# EAGLE design DualMotorCape-v6 (EAGLE 6.4)
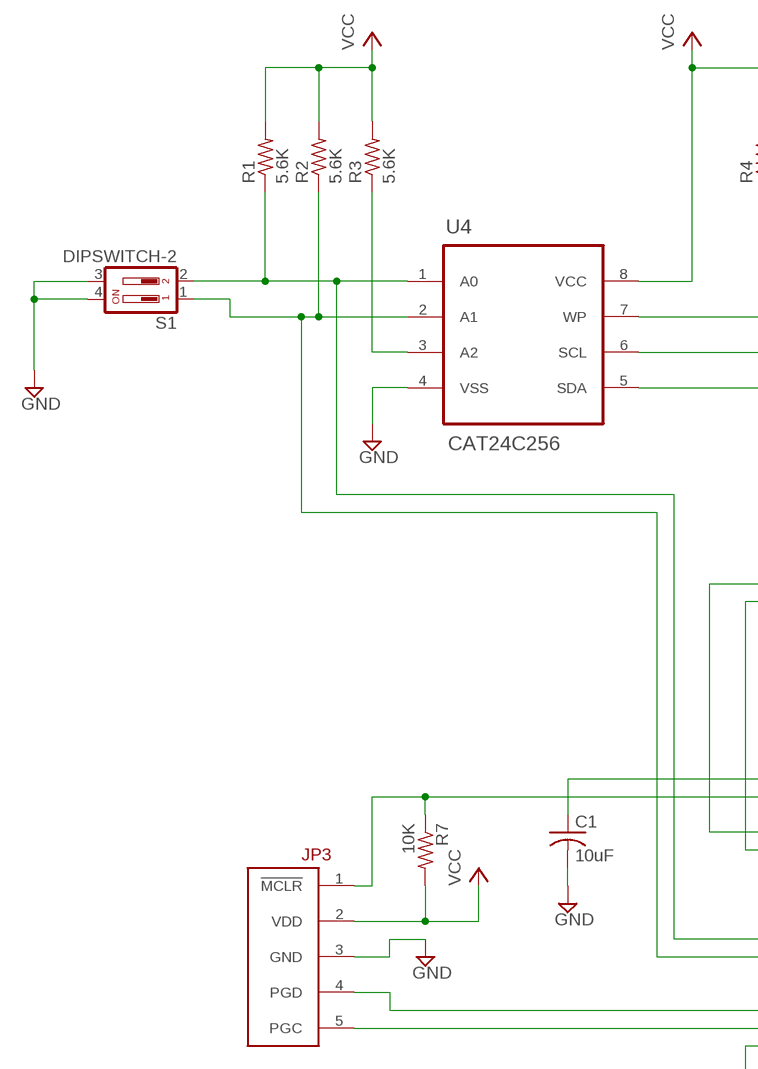
[diagram p0: schematic, sheet 1, part 1 of 2]
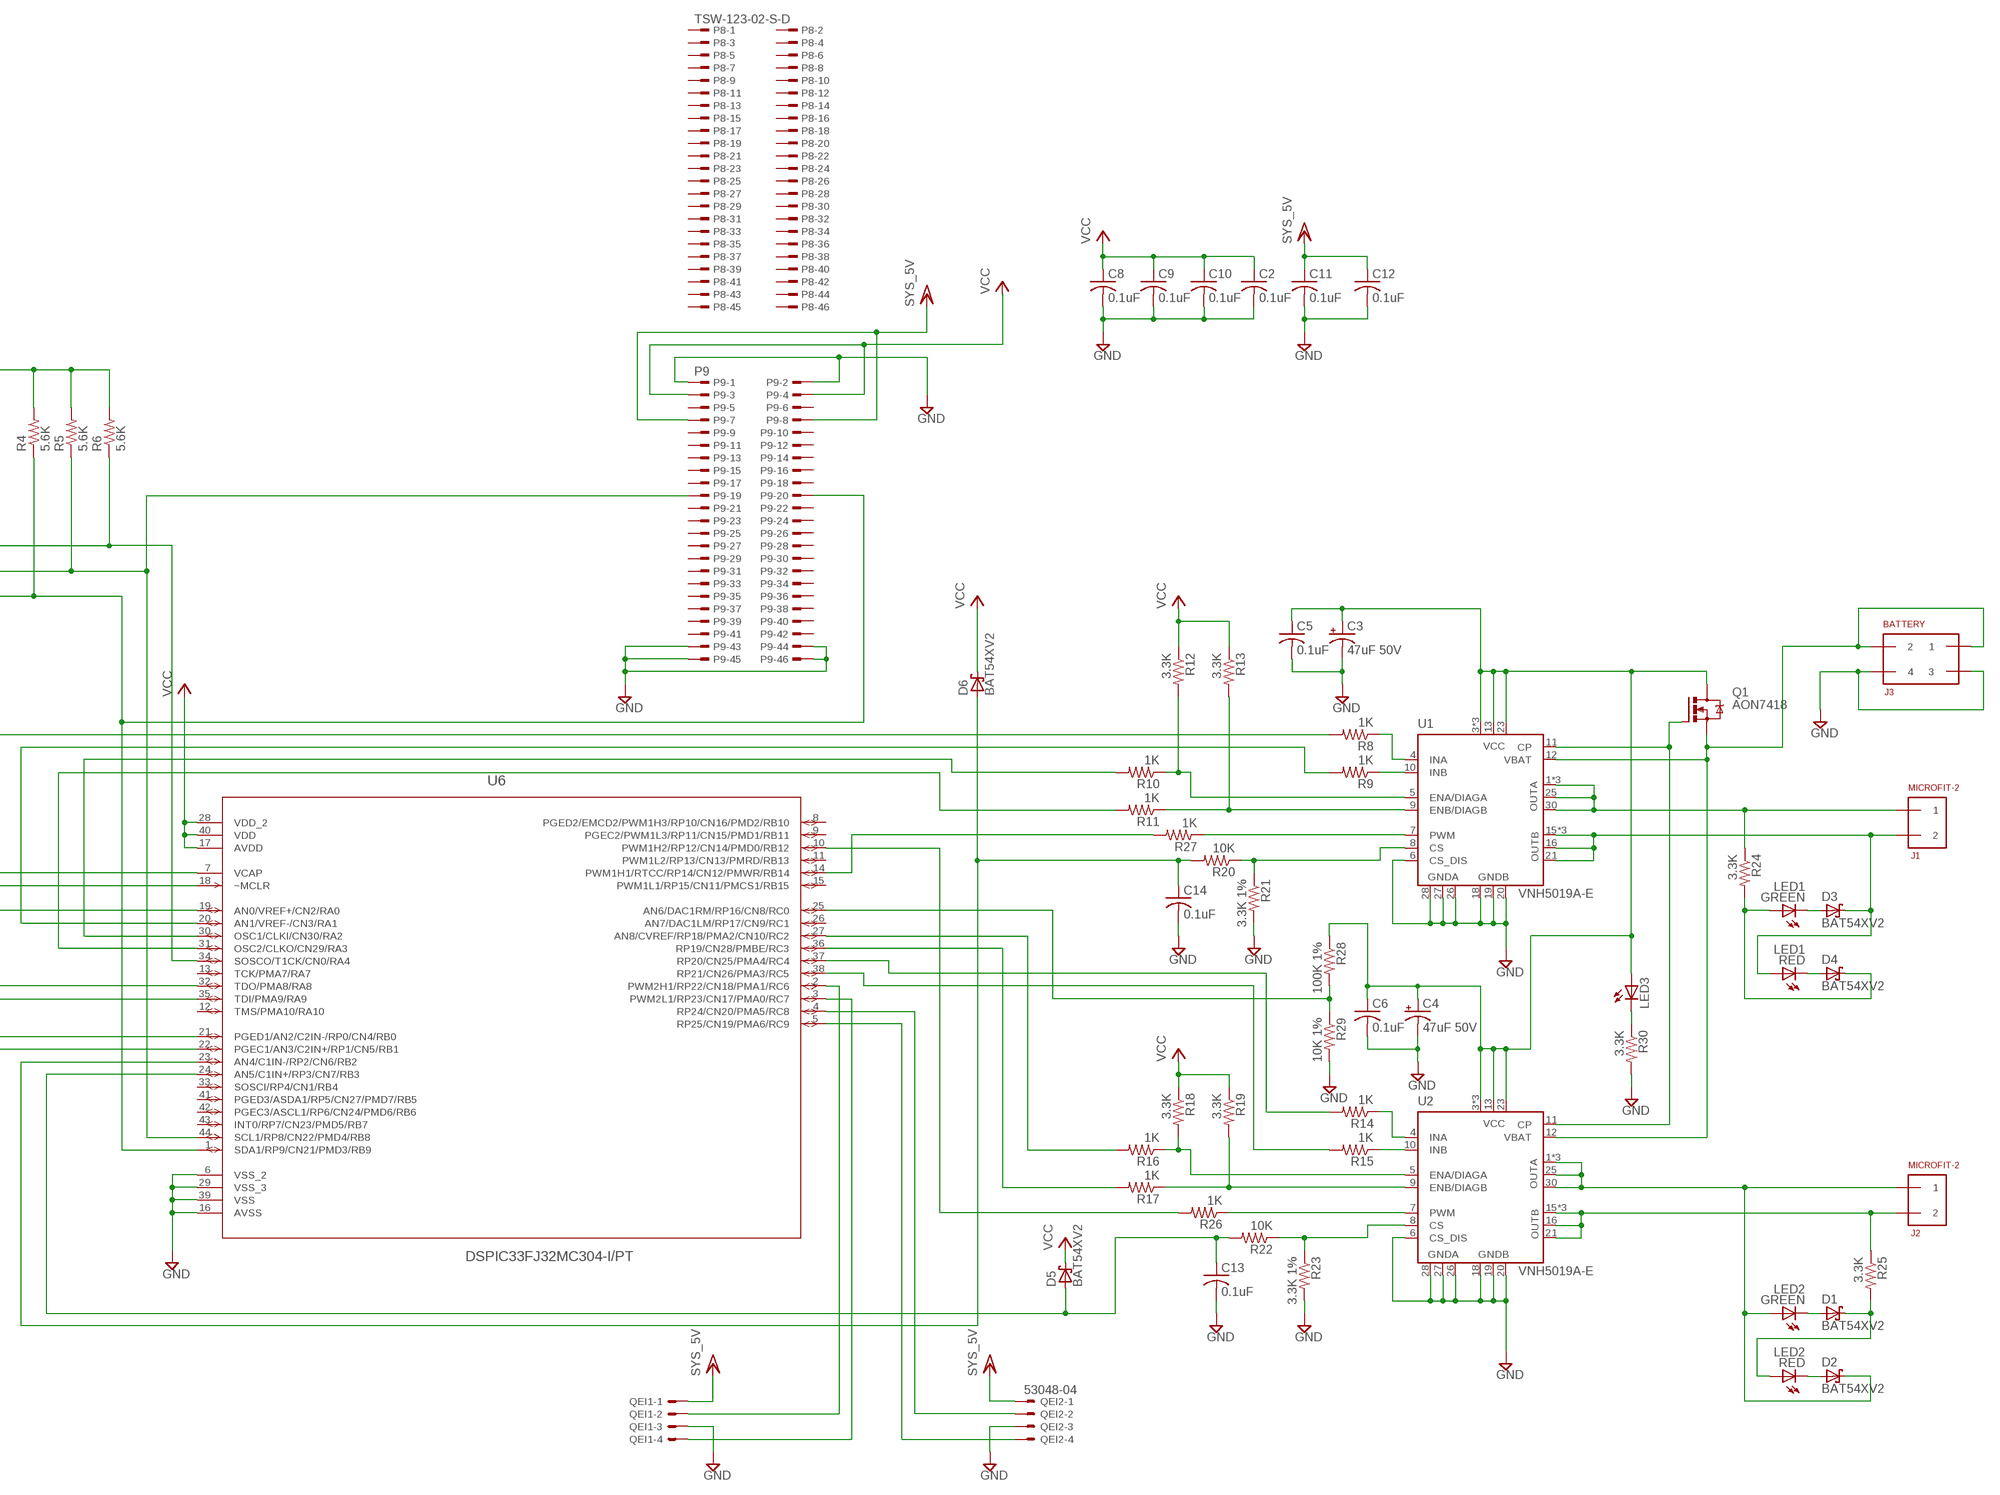
[diagram p1: schematic, sheet 1, part 2 of 2]

## Parts
C1  10uF  C-USC0805  [C0805]
C2  0.1uF  C-USC0603  [C0603]
C3  47uF 50V  CPOL-USUD-8X10  [UD-8X10_NICHICON]
C4  47uF 50V  CPOL-USUD-8X10  [UD-8X10_NICHICON]
C5  0.1uF  C-USC0603  [C0603]
C6  0.1uF  C-USC0603  [C0603]
C8  0.1uF  C-USC0603  [C0603]
C9  0.1uF  C-USC0603  [C0603]
C10  0.1uF  C-USC0603  [C0603]
C11  0.1uF  C-USC0603  [C0603]
C12  0.1uF  C-USC0603  [C0603]
C13  0.1uF  C-USC0603  [C0603]
C14  0.1uF  C-USC0603  [C0603]
D1  BAT54XV2  [SOD523]
D2  BAT54XV2  [SOD523]
D3  BAT54XV2  [SOD523]
D4  BAT54XV2  [SOD523]
D5  BAT54XV2  [SOD523]
D6  BAT54XV2  [SOD523]
J1  MICROFIT-2  [MICROFIT-2-R-TH]
J2  MICROFIT-2  [MICROFIT-2-R-TH]
J3  BATTERY  MICROFIT-4  [MICROFIT-4-R-TH]
JP3  ICD2/3-HEADER  [ICD2/3-HEADER]
LED1  KINGBRIGHT-BI-COLOR-LED  [LED-1.6X1.5MM-BI-COLOR]
LED2  KINGBRIGHT-BI-COLOR-LED  [LED-1.6X1.5MM-BI-COLOR]
LED3  LED-LNJP12X8ARA  [LED-603-PANASONIC]
P8  TSW-123-02-S-D  [TSW-123-02-S-D]
P9  P9  TSW-123-02-S-D  [TSW-123-02-S-D]
Q1  AON7418  MOSFET-N  [DFN3.3X3.3]
QEI1  53048-04  [53048-04]
QEI2  53048-04  [53048-04]
R1  5.6K  R-US_R0603  [R0603]
R2  5.6K  R-US_R0603  [R0603]
R3  5.6K  R-US_R0603  [R0603]
R4  5.6K  R-US_R0603  [R0603]
R5  5.6K  R-US_R0603  [R0603]
R6  5.6K  R-US_R0603  [R0603]
R7  10K  R-US_R0603  [R0603]
R8  1K  R-US_R0603  [R0603]
R9  1K  R-US_R0603  [R0603]
R10  1K  R-US_R0603  [R0603]
R11  1K  R-US_R0603  [R0603]
R12  3.3K  R-US_R0603  [R0603]
R13  3.3K  R-US_R0603  [R0603]
R14  1K  R-US_R0603  [R0603]
R15  1K  R-US_R0603  [R0603]
R16  1K  R-US_R0603  [R0603]
R17  1K  R-US_R0603  [R0603]
R18  3.3K  R-US_R0603  [R0603]
R19  3.3K  R-US_R0603  [R0603]
R20  10K  R-US_R0603  [R0603]
R21  3.3K 1%  R-US_R0603  [R0603]
R22  10K  R-US_R0603  [R0603]
R23  3.3K 1%  R-US_R0603  [R0603]
R24  3.3K  R-US_R0603  [R0603]
R25  3.3K  R-US_R0603  [R0603]
R26  1K  R-US_R0603  [R0603]
R27  1K  R-US_R0603  [R0603]
R28  100K 1%  R-US_R0603  [R0603]
R29  10K 1%  R-US_R0603  [R0603]
R30  3.3K  R-US_R0603  [R0603]
S1  DIPSWITCH-2  [DIPSWITCH-218-2]
U1  VNH5019A-E  [VNH5019A-E]
U2  VNH5019A-E  [VNH5019A-E]
U4  CAT24C256  [SOIC-8]
U6  DSPIC33FJ32MC304-I/PT  [QFP80P1200X1200X120-44N]

## Nets
GND: C1.2 C2.2 C3.- C4.- C5.2 C6.2 C8.2 C9.2 C10.2 C11.2 C12.2 C13.2 C14.2 J3.3 J3.4 JP3.3(GND) P9.1 P9.2 P9.43 P9.44 P9.45 P9.46 QEI1.3 QEI2.3 R21.2 R23.2 R29.2 R30.2 S1.3 S1.4 U1.6(CS_DIS) U1.18(GNDB) U1.19(GNDB) U1.20(GNDB) U1.26(GNDA) U1.27(GNDA) U1.28(GNDA) U2.6(CS_DIS) U2.18(GNDB) U2.19(GNDB) U2.20(GNDB) U2.26(GNDA) U2.27(GNDA) U2.28(GNDA) U4.4(VSS) U6.6(VSS_2) U6.16(AVSS) U6.29(VSS_3) U6.39(VSS)
M1+: J1.2 R24.1 U1.1(OUTA) U1.25(OUTA) U1.30(OUTA) U1.NC/OUTA(OUTA) U1.NC/OUTA@1(OUTA)
M1-: D3.C J1.1 LED1.1 U1.15(OUTB) U1.16(OUTB) U1.21(OUTB) U1.NC/OUTB(OUTB) U1.NC/OUTB@1(OUTB)
M2+: D2.C J2.2 LED2.3 U2.1(OUTA) U2.25(OUTA) U2.30(OUTA) U2.NC/OUTA(OUTA) U2.NC/OUTA@1(OUTA)
M2-: J2.1 R25.1 U2.15(OUTB) U2.16(OUTB) U2.21(OUTB) U2.NC/OUTB(OUTB) U2.NC/OUTB@1(OUTB)
N$1: D4.C LED1.3 R24.2
N$2: LED3.2(C) R30.1
N$4: Q1.4(G) U1.11(CP) U2.11(CP)
N$6: JP3.1(!MCLR) R7.1 U6.18(~MCLR)
N$9: D3.A LED1.4
N$10: R3.1 U4.3(A2)
N$11: R6.1 U4.7(WP) U6.34(SOSCO/T1CK/CN0/RA4)
N$12: P9.19 R5.1 U4.6(SCL) U6.44(SCL1/RP8/CN22/PMD4/RB8)
N$13: P9.20 R4.1 U4.5(SDA) U6.1(SDA1/RP9/CN21/PMD3/RB9)
N$14: JP3.5(PGC) U6.22(PGEC1/AN3/C2IN+/RP1/CN5/RB1)
N$16: JP3.4(PGD) U6.21(PGED1/AN2/C2IN-/RP0/CN4/RB0)
N$18: R11.1 R13.2 U1.9(ENB/DIAGB)
N$19: R10.1 R12.2 U1.5(ENA/DIAGA)
N$20: R27.2 U6.14(PWM1H1/RTCC/RP14/CN12/PMWR/RB14)
N$21: R8.1 U1.4(INA)
N$22: R9.1 U1.10(INB)
N$23: R15.1 U2.10(INB)
N$24: R14.1 U2.4(INA)
N$27: R17.2 U6.36(RP19/CN28/PMBE/RC3)
N$28: R22.1 R23.1 U2.8(CS)
N$29: R20.1 R21.1 U1.8(CS)
N$32: R10.2 U6.30(OSC1/CLKI/CN30/RA2)
N$33: R11.2 U6.31(OSC2/CLKO/CN29/RA3)
N$35: R14.2 U6.37(RP20/CN25/PMA4/RC4)
N$36: R15.2 U6.38(RP21/CN26/PMA3/RC5)
N$37: R16.2 U6.27(AN8/CVREF/RP18/PMA2/CN10/RC2)
N$39: QEI1.2 U6.2(PWM2H1/RP22/CN18/PMA1/RC6)
N$40: QEI1.4 U6.3(PWM2L1/RP23/CN17/PMA0/RC7)
N$43: R26.1 U2.7(PWM)
N$44: R28.2 R29.1 U6.25(AN6/DAC1RM/RP16/CN8/RC0)
N$45: D1.A LED2.4
N$46: R27.1 U1.7(PWM)
N$47: C1.1 U6.7(VCAP)
N$49: C3.+ C4.+ C5.1 C6.1 LED3.1(A) Q1.5(D) Q1.6(D) Q1.7(D) Q1.8(D) Q1.9(D) R28.1 U1.3(VCC) U1.13(VCC) U1.23(VCC) U1.NC/VCC(VCC) U1.NC/VCC@1(VCC) U2.3(VCC) U2.13(VCC) U2.23(VCC) U2.NC/VCC(VCC) U2.NC/VCC@1(VCC)
N$50: D4.A LED1.2
N$52: D2.A LED2.2
N$53: D1.C LED2.1 R25.2
PWM1H2: R26.2 U6.10(PWM1H2/RP12/CN14/PMD0/RB12)
RA0: R8.2 U6.19(AN0/VREF+/CN2/RA0)
RA1: R9.2 U6.20(AN1/VREF-/CN3/RA1)
RB2: C14.1 D6.A R20.2 U6.23(AN4/C1IN-/RP2/CN6/RB2)
RB3: C13.1 D5.A R22.2 U6.24(AN5/C1IN+/RP3/CN7/RB3)
RB6: QEI2.2 U6.4(RP24/CN20/PMA5/RC8)
RB7: QEI2.4 U6.5(RP25/CN19/PMA6/RC9)
RC8: R1.1 S1.2 U4.1(A0) U6.32(TDO/PMA8/RA8)
RC9: R2.1 S1.1 U4.2(A1) U6.35(TDI/PMA9/RA9)
U2ENA: R16.1 R18.2 U2.5(ENA/DIAGA)
U2ENB: R17.1 R19.2 U2.9(ENB/DIAGB)
VBAT: J3.1 J3.2 Q1.1(S) Q1.2(S) Q1.3(S) U1.12(VBAT) U2.12(VBAT)
VCC: C2.1 C8.1 C9.1 C10.1 D5.C D6.C JP3.2(VDD) P9.3 P9.4 R1.2 R2.2 R3.2 R4.2 R5.2 R6.2 R7.2 R12.1 R13.1 R18.1 R19.1 U4.8(VCC) U6.17(AVDD) U6.28(VDD_2) U6.40(VDD)
VCC/2: C11.1 C12.1 P9.7 P9.8 QEI1.1 QEI2.1 ; supply symbol labelled SYS_5V
Unconnected: P8.1 P8.2 P8.3 P8.4 P8.5 P8.6 P8.7 P8.8 P8.9 P8.10 P8.11 P8.12 P8.13 P8.14 P8.15 P8.16 P8.17 P8.18 P8.19 P8.20 P8.21 P8.22 P8.23 P8.24 P8.25 P8.26 P8.27 P8.28 P8.29 P8.30 P8.31 P8.32 P8.33 P8.34 P8.35 P8.36 P8.37 P8.38 P8.39 P8.40 P8.41 P8.42 P8.43 P8.44 P8.45 P8.46 P9.5 P9.6 P9.9 P9.10 P9.11 P9.12 P9.13 P9.14 P9.15 P9.16 P9.17 P9.18 P9.21 P9.22 P9.23 P9.24 P9.25 P9.26 P9.27 P9.28 P9.29 P9.30 P9.31 P9.32 P9.33 P9.34 P9.35 P9.36 P9.37 P9.38 P9.39 P9.40 P9.41 P9.42 U6.8(PGED2/EMCD2/PWM1H3/RP10/CN16/PMD2/RB10) U6.9(PGEC2/PWM1L3/RP11/CN15/PMD1/RB11) U6.11(PWM1L2/RP13/CN13/PMRD/RB13) U6.12(TMS/PMA10/RA10) U6.13(TCK/PMA7/RA7) U6.15(PWM1L1/RP15/CN11/PMCS1/RB15) U6.26(AN7/DAC1LM/RP17/CN9/RC1) U6.33(SOSCI/RP4/CN1/RB4) U6.41(PGED3/ASDA1/RP5/CN27/PMD7/RB5) U6.42(PGEC3/ASCL1/RP6/CN24/PMD6/RB6) U6.43(INT0/RP7/CN23/PMD5/RB7)

## Library data of the parts
C1 C2 C5 C6 C8-C14 = rcl:C-US: CAPACITOR, American symbol
C3 C4 = rcl:CPOL-US: POLARIZED CAPACITOR, American symbol; DIGIKEY: 493-2303-1-ND
D1-D6 = MyCustom:BAT54XV2: Schottky Diodes Source: Fairchild .. BAT54.pdf; DIGIKEY#: BAT54XV2CT-ND
J1 J2 = MyCustom:MICROFIT-2
J3 = MyCustom:MICROFIT-4
JP3 = MyCustom:ICD2/3-HEADER
LED1 LED2 = MyCustom:KINGBRIGHT-BI-COLOR-LED: BI-COLOR SMD CHIP LED 1.6x1.5mm http://www.us.kingbright.com/images/catalog/SPEC/APTB1615ESGC-F01.pdf
LED3 = MyCustom:LED-LNJP12X8ARA
P8 P9 = con-samtec:TSW-123-02-S-D: THROUGH-HOLE .025" SQ POST HEADER Source: Samtec TSW.pdf; OC_FARNELL: unknown; OC_NEWARK: unknown
Q1 = MyCustom:MOSFET-N: MOSFET N-Channel http://www.aosmd.com/res/data_sheets/AON7418.pdf http://www.aosmd.com/res/packaging_information/DFN3.3x3.3.pdf
QEI1 QEI2 = con-molex:53?-04: CONNECTOR wire to board 1.25 mm (.049 inch) pitch header; MF: MOLEX; MPN: 53048-0410; OC_FARNELL: 1462887; OC_NEWARK: 57H4721
R1-R30 = rcl:R-US_: RESISTOR, American symbol
S1 = MyCustom:DIPSWITCH-2; DIGIKEY#: CT2182LPST-ND
U1 U2 = MyCustom:VNH5019A-E
U4 = MyCustom:CAT24C256: ON Semi CAT24C256 CMOS Serial EEPROM http://www.onsemi.com/pub_link/Collateral/CAT24C256-D.PDF
U6 = MyCustom:DSPIC33FJ32MC304-I/PT: 16-bit Digital Signal Controllers; DESCRIPTION: 16-bit Digital Signal Controllers; MPN: dspic33fj32mc304-I/pt; OC_FARNELL: 1576821; OC_NEWARK: 39M8208; PACKAGE: TQFP-44; SUPPLIER: Microchip

## Board
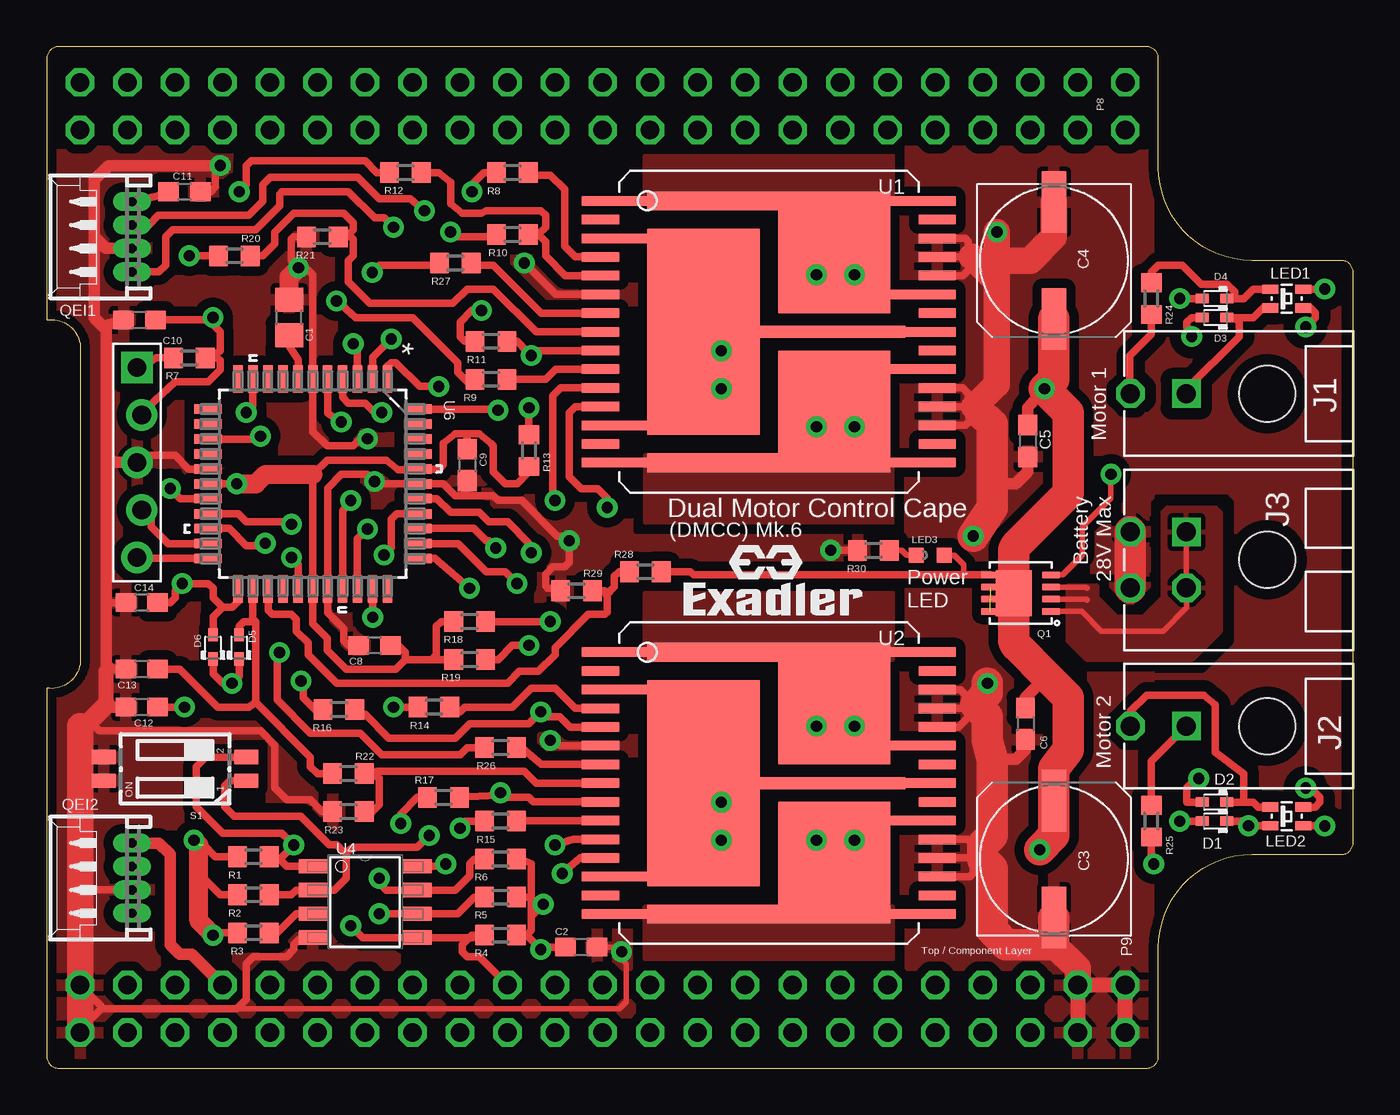
[diagram p2: board, top side]
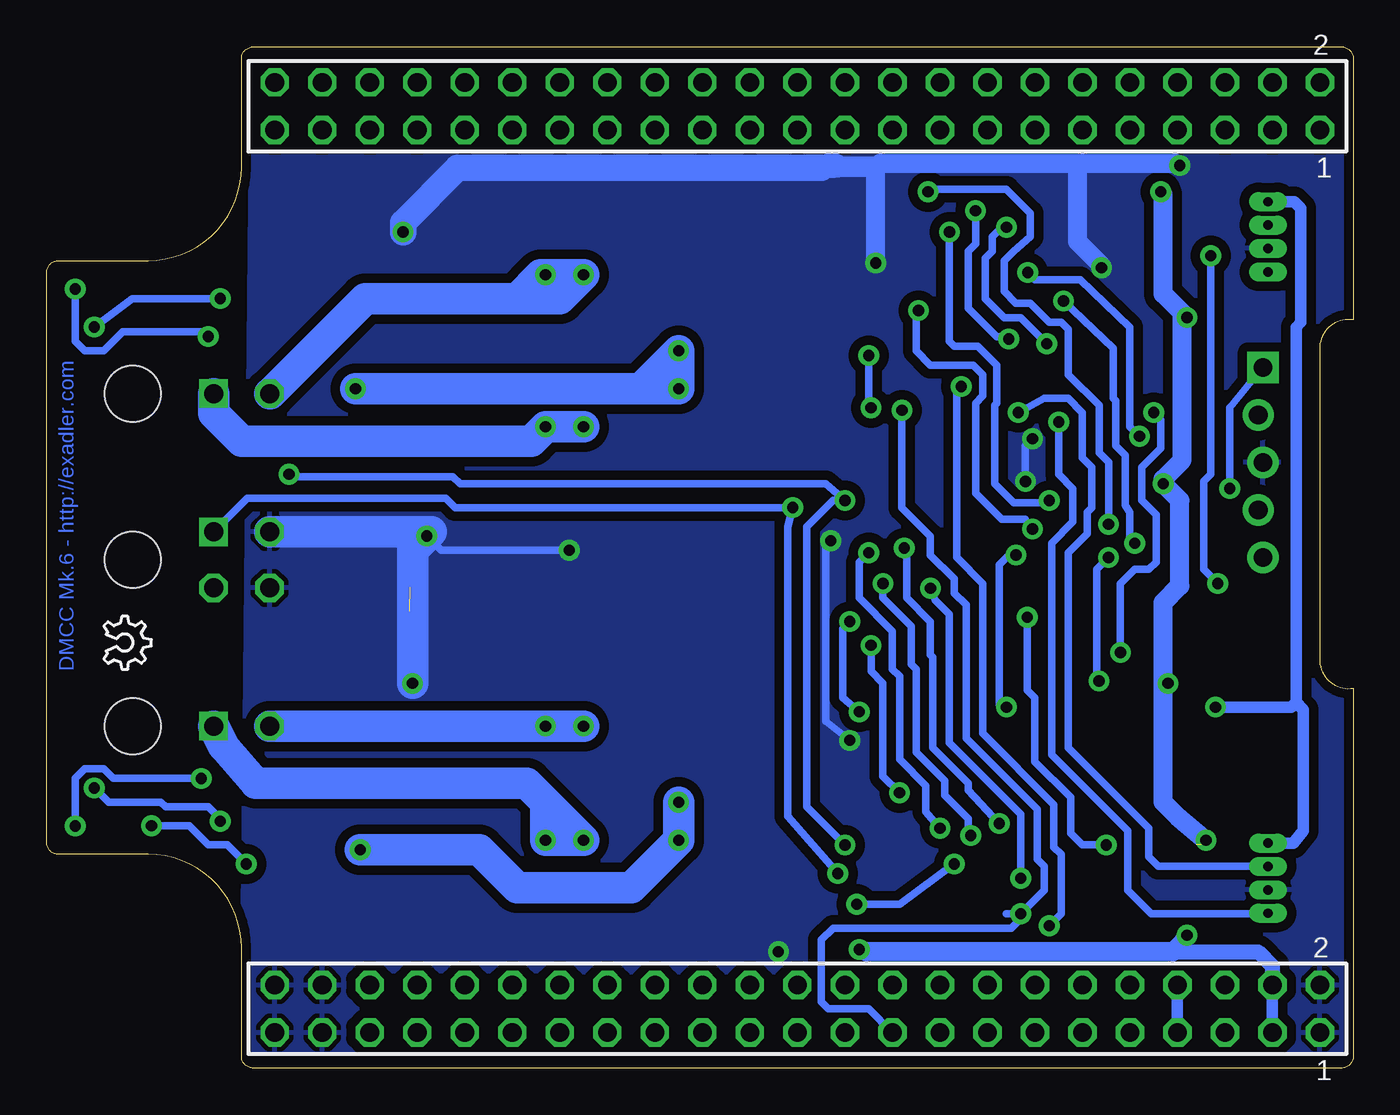
[diagram p3: board, bottom side, seen from below]

Size 69.85 x 54.61 mm. Coordinates in mm from the lower left corner, seen from the top.
Outline: 0,20.32 0,0.64 arc90 0.64,0 58.8,0 arc90 59.44,0.64 59.44,6.43 arc-90 64.44,11.43 69.22,11.43 arc90 69.85,12.06 69.85,42.55 arc90 69.22,43.18 64.44,43.18 arc-90 59.44,48.18 59.44,53.98 arc90 58.8,54.61 0.64,54.61 arc90 0,53.98 0,40.01 arc-90 1.78,38.73 1.78,21.59 arc-90 0,20.32
Copper layers (1*16): Top 0.035mm / dielectric 1.5mm / Bottom 0.035mm
Design rules "10-10-DRC": minimum track width 10mil, minimum drill 20mil, track to track 10mil, track to pad 10mil, pad to pad 10mil, via to via 10mil, smd to smd 4mil, copper to edge 10mil, drill to drill 10mil, minimum pad ring 10mil, minimum via ring 10mil, stop-mask expansion 4mil, vias tented up to drill 25mil, thermal gap 10mil

### Footprints (pad centres in the part's own frame; a part is rotated, then mirrored left to right if it is on the bottom)
C0805 = smd 1.3 x 1.5: 1 -0.95,0; 2 0.95,0
C0603 = smd 1.1 x 1: 1 -0.85,0; 2 0.85,0
UD-8X10_NICHICON = smd 3.3 x 1.3: + 3.125,0; - -3.125,0
SOD523 = smd 0.7 x 0.5: A 0.7,0; C -0.6,0
MICROFIT-2-R-TH = drill 1.016 square: 1 0,8.915 | drill 1.016 octagon: 2 0,11.913 | hole 2.997: 0,4.597
MICROFIT-4-R-TH = drill 1.016 square: 1 1.499,8.915 | drill 1.016 octagon: 2 -1.499,8.915; 3 1.499,11.913; 4 -1.499,11.913 | hole 2.997: 0,4.597
ICD2/3-HEADER = drill 1 pad 1.676 square: 1 0,6.35 | drill 1 pad 1.676: 2 0.254,3.81; 3 0,1.27; 4 0.254,-1.27; 5 0,-3.81
LED-1.6X1.5MM-BI-COLOR = smd 0.85 x 0.5: 1 0.875,0.5; 2 -0.875,0.5; 3 0.875,-0.5; 4 -0.875,-0.5
LED-603-PANASONIC = smd 0.8 x 0.8: 1 0,0.75; 2 0,-0.75
TSW-123-02-S-D = drill 1 pad 1.5 octagon: 1 27.94,-1.27; 2 27.94,1.27; 3 25.4,-1.27; 4 25.4,1.27; 5 22.86,-1.27; 6 22.86,1.27; 7 20.32,-1.27; 8 20.32,1.27; 9 17.78,-1.27; 10 17.78,1.27; 11 15.24,-1.27; 12 15.24,1.27; 13 12.7,-1.27; 14 12.7,1.27; 15 10.16,-1.27; 16 10.16,1.27; 17 7.62,-1.27; 18 7.62,1.27; 19 5.08,-1.27; 20 5.08,1.27; 21 2.54,-1.27; 22 2.54,1.27; 23 0,-1.27; 24 0,1.27; 25 -2.54,-1.27; 26 -2.54,1.27; 27 -5.08,-1.27; 28 -5.08,1.27; 29 -7.62,-1.27; 30 -7.62,1.27; 31 -10.16,-1.27; 32 -10.16,1.27; 33 -12.7,-1.27; 34 -12.7,1.27; 35 -15.24,-1.27; 36 -15.24,1.27; 37 -17.78,-1.27; 38 -17.78,1.27; 39 -20.32,-1.27; 40 -20.32,1.27; 41 -22.86,-1.27; 42 -22.86,1.27; 43 -25.4,-1.27; 44 -25.4,1.27; 45 -27.94,-1.27; 46 -27.94,1.27
DFN3.3X3.3 = smd 0.95 x 0.35: 1 -1.62,0.975; 2 -1.62,0.325; 3 -1.62,-0.325; 4 -1.62,-0.975; 5 1.62,-0.975; 6 1.62,-0.325; 7 1.62,0.325; 8 1.62,0.975 | smd 1.93 x 2.45: 9 0.381,0
53048-04 = drill 0.5 pad 0.698 long: 1 1.875,-1.25; 2 0.625,-1.25; 3 -0.625,-1.25; 4 -1.875,-1.25
R0603 = smd 1 x 1.1: 1 -0.85,0; 2 0.85,0
DIPSWITCH-218-2 = smd 0.76 x 1.27: 1 -0.635,-3.81; 2 0.635,-3.81; 3 0.635,3.81; 4 -0.635,3.81
VNH5019A-E = smd 0.508 x 12: 1 -7,-4; 15 7,-4; 16 7,4; 30 -7,4 | smd 0.508 x 2: 2 -6,-9; 4 -4,-9; 5 -3,-9; 6 -2,-9; 7 -1,-9; 8 0,-9; 9 1,-9; 10 2,-9; 11 3,-9; 12 4,-9; 14 6,-9; 17 6,9; 18 5,9; 19 4,9; 20 3,9; 22 1,9; 24 -1,9; 26 -3,9; 27 -4,9; 28 -5,9; 29 -6,9 | smd 0.508 x 4: 3 -5,-8; 13 5,-8; 21 2,8; 23 0,8; 25 -2,8 | smd 6.5 x 6: NC/OUTA -4.25,3.5; NC/OUTB 4.25,3.5 | smd 1 x 7.5: NC/OUTA@1 -7,-2.755; NC/OUTB@1 7,-2.755 | smd 11 x 6: NC/VCC 0,-3.5 | smd 0.65 x 8.3: NC/VCC@1 0,3.145
SOIC-8 = smd 1.524 x 0.762: 1 -2.794,1.905; 2 -2.794,0.635; 3 -2.794,-0.635; 4 -2.794,-1.905; 5 2.794,-1.905; 6 2.794,-0.635; 7 2.794,0.635; 8 2.794,1.905
QFP80P1200X1200X120-44N = smd 1.473 x 0.508: 1 -5.613,3.988; 2 -5.613,3.2; 3 -5.613,2.388; 4 -5.613,1.6; 5 -5.613,0.787; 6 -5.613,0; 7 -5.613,-0.787; 8 -5.613,-1.6; 9 -5.613,-2.388; 10 -5.613,-3.2; 11 -5.613,-3.988; 23 5.613,-3.988; 24 5.613,-3.2; 25 5.613,-2.388; 26 5.613,-1.6; 27 5.613,-0.787; 28 5.613,0; 29 5.613,0.787; 30 5.613,1.6; 31 5.613,2.388; 32 5.613,3.2; 33 5.613,3.988 | smd 0.508 x 1.473: 12 -3.988,-5.613; 13 -3.2,-5.613; 14 -2.388,-5.613; 15 -1.6,-5.613; 16 -0.787,-5.613; 17 0,-5.613; 18 0.787,-5.613; 19 1.6,-5.613; 20 2.388,-5.613; 21 3.2,-5.613; 22 3.988,-5.613; 34 3.988,5.613; 35 3.2,5.613; 36 2.388,5.613; 37 1.6,5.613; 38 0.787,5.613; 39 0,5.613; 40 -0.787,5.613; 41 -1.6,5.613; 42 -2.388,5.613; 43 -3.2,5.613; 44 -3.988,5.613

### Placement (x,y rotation side)
C1  12.95,40.13 90 top
C2  28.57,6.48 0 top
C3  53.85,11.18 90 top
C4  53.85,43.18 270 top
C5  52.45,33.53 270 top
C6  52.32,18.41 270 top
C8  17.53,22.61 180 top
C9  22.48,32.26 270 top
C10  4.95,40.01 180 top
C11  7.37,46.86 0 top
C12  5.08,19.3 180 top
C13  5.08,21.34 180 top
C14  5.08,24.89 180 top
D1  62.48,13.21 180 top
D2  62.48,14.22 180 top
D3  62.48,40.13 180 top
D4  62.48,41.15 180 top
D5  10.29,22.48 90 top
D6  8.89,22.48 90 top
J1  69.85,36.07 90 top
J2  69.85,18.29 90 top
J3  69.85,27.18 90 top
JP3  4.83,31.11 0 top
LED1  66.29,41.15 180 top
LED2  66.29,13.46 180 top
LED3  47.24,27.43 270 top
P8  29.72,51.44 0 bottom
P9  29.72,3.17 0 bottom
Q1  52.07,25.4 180 top
QEI1  3.3,44.45 90 top
QEI2  3.3,10.16 90 top
R1  11.05,11.3 180 top
R2  11.05,9.27 180 top
R3  11.05,7.24 180 top
R4  24.26,7.11 0 top
R5  24.26,9.14 0 top
R6  24.26,11.18 0 top
R7  7.62,37.97 0 top
R8  24.89,47.88 180 top
R9  23.75,36.83 180 top
R10  24.89,44.58 180 top
R11  23.75,38.86 180 top
R12  19.18,47.88 0 top
R13  25.78,33.02 90 top
R14  20.7,19.3 180 top
R15  24.26,13.21 180 top
R16  15.62,19.18 180 top
R17  21.21,14.48 180 top
R18  22.61,23.88 0 top
R19  22.61,21.84 0 top
R20  10.03,43.43 180 top
R21  14.73,44.45 180 top
R22  16.13,15.75 180 top
R23  16.13,13.72 180 top
R24  59.05,41.15 90 top
R25  59.05,13.21 270 top
R26  24.26,17.14 180 top
R27  21.84,43.05 180 top
R28  32,26.54 180 top
R29  28.32,25.53 180 top
R30  44.2,27.69 180 top
S1  6.86,16 90 top
U1  38.61,39.37 270 top
U2  38.61,15.24 270 top
U4  17.02,8.89 0 top
U6  14.22,31.24 270 top
U$1  [EXADLER-LOGO]  33.15,24 0 top
U$2  [OSHW_6X100_NOTEXT]  66.8,21.34 90 top

### Tracks (layer width: path | path; a pad name or v marks a point on that pad's centre or on a via)
GND  (via drill 0.6)
  Top 0.305: v30.73,6.22 30.48,6.48 C2.2 30.35,6.48 30.73,6.1 30.73,5.84 30.99,5.59 30.99,3.56 30.61,3.17 10.16,3.17
  Top 0.406: U1.28 49.1,44.37 49.28,44.2 49.28,43.37 | U1.26 48.97,42.37 49.72,43.12 | U1.18 49.1,34.37 49.28,34.54 49.4,34.54 49.91,35.05 | U1.20 48.97,36.37 49.28,36.07 49.28,35.37 | U1.27 49.28,43.37 | 49.28,43.37 49.47,43.37 | U1.19 49.28,35.37 | 49.28,35.37 49.59,35.37 | U2.20 49.23,12.24 49.78,11.68 49.47,11.37 49.47,11.24 | U2.19 49.47,11.24 | 49.47,11.24 49.53,11.18 49.53,10.41 49.36,10.24 U2.18 | U2.28 48.85,20.24 49.66,19.43 49.78,19.3 49.72,19.24 | U2.27 49.72,19.24 | U2.26 48.72,18.24 49.72,19.24 | U1.6 27.21,41.37 25.65,42.93 25.4,42.93 v25.53,43.05 | 22.35,30.61 21.84,30.61 21.21,31.24 U6.39 17.78,31.24 v17.53,31.37 17.14,31.75 15.75,31.75 15.01,31.01 U6.29 15.01,24.36 15.88,23.5 15.88,22.86 16.13,22.61 C8.2 | 22.35,30.61 22.35,31.28 C9.2 | U2.6 27.46,17.24 v26.92,17.53 | P9.1 1.78,2.03 2.92,3.17 | 2.92,3.17 10.16,3.17 10.67,3.68 10.67,5.59 11.05,5.97 12.83,5.97 13.21,6.35 13.21,6.6 13.46,6.86 14.1,6.86 U4.4 | 2.92,3.17 2.92,3.3 P9.2 | QEI2.3 1.92,9.54 1.78,9.4 | S1.4 1.91,15.37 1.78,15.24 | S1.3 1.91,16.64 1.78,16.51 | JP3.3 5.21,32.77 6.86,32.77 7.59,32.03 U6.16 | R29.2 27.6,25.65 26.8,25.65 26.67,25.78 26.67,26.42 27.05,26.8 27.69,26.8 27.94,27.05 v27.94,28.19 27.69,28.45 27.3,28.45 25.4,30.35 24.13,30.35 23.88,30.61 22.35,30.61 | v17.14,33.66 16.76,33.66 16.38,33.27 14.99,33.27 14.22,34.04 U6.6 14.22,42.42 13.84,42.8 v13.46,42.8 13.08,43.18 13.08,44.32 13.21,44.45 R21.2 | R30.2 v41.91,27.69 | 2.03,18.54 2.29,18.54 2.79,18.03 11.43,18.03 12.19,17.27 12.19,14.99 12.83,14.35 14.1,14.35 14.73,13.72 R23.2 | C11.2 8.76,46.86 9.02,47.12 9.02,48.01 v9.27,48.26 | C13.2 3.3,21.34 3.17,21.34
  Top 0.406: C14.2 3.17,24.89
  Top 0.61: 3.17,21.34 3.17,24.89 3.17,32.51 | 3.17,32.51 3.17,39.62 3.3,39.75 C10.2 | JP3.3 3.3,32.38 3.17,32.51 | C6.2 52.32,17.02 51.82,16.51 50.55,16.51 | C5.2 52.45,31.88 51.82,31.24 51.05,31.24 50.55,30.73 | C12.2 3.3,19.3 3.17,19.43 | QEI1.3 3.17,43.83 2.54,44.45 | 9.4,48.26 v9.27,48.26 3.3,48.26 2.54,47.5 2.54,44.45 | 2.54,44.45 2.54,44.2 2.54,40.13 3.05,39.62
  Top 0.813: P9.43 P9.44 P9.46 P9.45 | C1.2 12.95,41.78 | 3.17,19.43 3.17,21.21 3.3,21.34
  Top 1.016: 1.78,18.29 2.03,18.29 2.29,18.54 3.17,19.43 | 12.95,41.78 12.95,42.29 v13.46,42.8
  Top 1.422: 49.91,35.05 49.59,35.37 50.8,36.58 50.8,42.04 | 50.8,42.04 49.72,43.12 49.66,43.18 | 49.66,43.18 49.47,43.37 | v50.8,44.7 50.8,42.04 | 53.85,6.6 55.12,5.33 P9.44 | C4.- 53.85,44.45 52.58,43.18 49.66,43.18 | P9.1 P9.2 1.78,9.4 1.78,15.24 1.78,16.51 | 1.78,18.29 1.78,16.76 1.91,16.64
  Top 1.676: C3.- 53.85,6.6 51.31,6.6 50.55,7.37 50.55,10.67 50.04,11.18 50.04,11.94 50.55,12.45 50.55,16.51 50.29,17.53 50.29,18.8 49.78,19.3 | 49.91,35.05 50.55,34.42 50.55,30.73 50.55,29.97 v49.53,28.45 | J3.4 J3.3 | v50.29,20.57 50.29,20.07 49.66,19.43
  Bottom 0.406: 28.45,48.13 28.19,48.13 28.07,48.26 | v26.92,17.53 28.19,18.54 28.19,27.94 v27.94,28.19 | v17.53,31.37 17.53,33.27 v17.14,33.66 | v41.91,27.69 48.77,27.69 v49.53,28.45
  Bottom 0.61: 25.53,48.13 25.4,48.26
  Bottom 1.016: v25.53,43.05 25.53,48.13 27.56,48.13 27.69,48.26 25.4,48.26 25.27,48.39 14.48,48.39 | v9.27,48.26 9.53,48.39 14.48,48.39 | v13.46,42.8 13.46,42.93 14.73,44.2 14.73,48.13 14.48,48.39
  Bottom 1.27: 28.07,48.26 27.69,48.26
  Bottom 1.422: 28.45,48.13 47.88,48.13 50.8,45.21 v50.8,44.7
  Bottom 1.676: J3.3 49.3,28.68 v49.53,28.45 50.29,27.69 v50.29,20.57
  pour Top (isolate 0.61, rank 2): 69.6,42.93 57.66,42.93 57.66,11.68 69.6,11.68
  pour Bottom (isolate 0.508, rank 2): 0.51,48.77 0.51,0.76 59.44,0.76 58.93,48.77
  pour Top (isolate 0.508, rank 2): 0.51,0.76 58.93,0.76 58.93,49.02 0.25,49.02 0.25,0.76
M1+  (via drill 0.6)
  Top 0.305: U1.25 42.93,41.4 43.18,42.67
  Top 0.406: R24.1 59.05,39.24 57.91,38.1 57.91,36.09 J1.2
  Top 1.676: v43.18,42.42 43.18,42.67 43.18,43.43 | U1.NC/OUTA 42.1,43.62 v41.15,42.42
  Bottom 1.676: J1.2 57.91,36.07 52.83,41.15 42.42,41.15 v41.15,42.42 42.93,42.42 44.2,41.15 44.7,41.15 43.43,42.42 v43.18,42.42
  pour Top: 32,46.23 32,48.77 45.21,48.77 45.21,46.23
M1-  (via drill 0.6)
  Top 0.305: U1.21 44.36,37.37 U1.NC/OUTB
  Top 0.406: LED1.1 65.03,40.65 64.52,40.13 63.5,40.13 | 63.5,40.13 D3.C | 63.5,40.13 63.75,39.88 63.75,39.12 60.94,36.3 J1.1
  Top 1.676: U1.NC/OUTB 41.98,35.12 v41.15,34.29
  Bottom 1.676: J1.1 60.94,35.03 59.44,33.53 43.94,33.53 v43.18,34.29 v41.15,34.29
  pour Top: 32,32.77 32,29.21 45.21,29.21 45.21,32.51
M2+  (via drill 0.6)
  Top 0.305: U2.25 43.18,17.27 v43.18,18.29 | 43.18,19.81 U2.30 U2.1
  Top 0.406: LED2.3 64.78,13.96 64.52,14.22 64.01,14.22 | D2.C 64.01,14.22 | J2.2 57.94,19.07 58.8,19.94 61.85,19.94 62.48,19.43 62.48,16.89 64.01,15.75 64.01,14.22
  Top 1.676: v43.18,18.29 43.18,19.81 | v41.15,18.29 41.15,18.53 U2.NC/OUTA
  Bottom 1.676: J2.2 v41.15,18.29
  pour Top (isolate 0.406): 32,21.84 32,25.4 45.21,25.4 45.21,21.84
M2-  (via drill 0.6)
  Top 0.305: U2.16 43.13,11.61 | 43.13,11.61 43.18,11.94 | 43.13,11.61 43.18,12.95 43.18,13.21 43.21,13.24 U2.21
  Top 0.406: R25.1 59.05,16.41 J2.1
  Top 1.676: v43.18,12.19 43.18,11.94 | v41.15,12.19 41.03,12.19 U2.NC/OUTB
  Bottom 1.676: J2.1 60.43,17.25 58.67,15.24 44.2,15.24 v41.15,12.19 v43.18,12.19 43.18,13.97
  pour Top (isolate 0.305): 32,8.64 45.21,8.64 45.21,5.84 32,5.84
N$1
  Top 0.406: LED1.3 65.29,41.65 65.28,41.66 64.52,41.66 64.01,41.15 63.5,41.15 | R24.2 59.05,42.55 59.44,42.93 60.71,42.93 61.72,41.91 63.1,41.91 63.51,41.5 63.51,41.16 63.5,41.15 | 63.5,41.15 D4.C
N$2
  Top 0.305: R30.1 45.72,27.69 45.97,27.43 LED3.2
N$4  (via drill 0.6)
  Top 0.305: Q1.4 54.31,26.38 55.37,27.43 55.37,28.96 56.9,30.48 v56.9,31.75
  Top 0.406: U1.11 27.48,36.37 27.05,35.94 27.05,30.48 v27.18,30.35 | U2.11 28.15,12.24 v27.18,11.94
  Bottom 0.406: v56.9,31.75 56.77,31.62 48.13,31.62 47.75,31.24 28.19,31.24 v27.18,30.35 27.81,30.35 29.21,28.96 29.21,13.97 v27.18,11.94
N$6  (via drill 0.6)
  Top 0.406: U6.18 7.14,30.45 v6.6,30.99 | JP3.1 5.21,37.47 5.84,37.97 R7.1
  Bottom 0.406: v6.6,30.99 6.6,35.31 JP3.1
N$9  (via drill 0.6)
  Top 0.406: LED1.4 68.32,41.65 v68.33,41.66 | v61.21,39.12 61.21,39.37 60.96,39.62 60.96,39.88 61.21,40.13 D3.A
  Bottom 0.406: v68.33,41.66 68.33,38.86 67.82,38.35 66.8,38.35 65.79,39.37 61.47,39.37 v61.21,39.12
N$10
  Top 0.406: U4.3 13.34,8.26 12.32,7.24 R3.1
N$11  (via drill 0.6)
  Top 0.406: U6.34 20.75,27.25 v22.61,25.65 | v17.78,10.16 17.78,9.91 18.16,9.53 U4.7 21.84,9.53 22.61,10.29 22.61,10.92 22.86,11.18 R6.1
  Bottom 0.406: v22.61,25.65 22.35,25.02 21.59,24.26 21.59,17.4 17.78,13.59 v17.78,10.16
N$12  (via drill 0.6)
  Top 0.406: v17.78,8.26 U4.6 21.97,8.26 22.86,9.14 R5.1 | U6.44 23.57,35.23 v24.13,35.18
  Bottom 0.406: P9.19 25.91,3.17 28.07,3.17 28.45,3.56 28.45,6.86 27.81,7.49 18.29,7.49 17.78,8 v17.78,8.26 | 18.54,8.26 v17.78,8.26 | v24.13,35.18 24.13,29.97 22.61,28.45 22.61,27.43 21.34,26.16 21.34,25.4 20.7,24.77 20.7,17.65 16.89,13.84 16.89,11.18 16.51,10.79 16.51,9.53 v17.78,8.26
N$13  (via drill 0.6)
  Top 0.406: P9.20 23.11,5.97 22.48,5.97 22.23,6.22 22.23,6.6 22.73,7.11 R4.1 22.77,6.99 U4.5 16.89,6.99 v16.26,7.62 | U6.1 18.21,37.52 18.41,37.72 18.67,37.72 19.94,36.45 v20.95,36.45
  Bottom 0.406: 16.38,7.75 v16.26,7.62 15.62,8.26 15.62,11.43 16,11.81 16,14.1 19.81,17.91 19.81,25.91 21.21,27.3 21.21,36.32 21.08,36.32 v20.95,36.45
N$14
  Top 0.406: U6.22 4.88,27.25 JP3.5
N$16
  Top 0.406: JP3.4 5.59,29.34 5.59,28.96 6.5,28.04 U6.21
N$18  (via drill 0.6)
  Top 0.406: U1.9 25.64,38.37 | 25.64,38.37 25.15,38.86 R11.1 | 25.64,38.37 v25.91,38.1 | R13.2 v25.78,35.31
  Bottom 0.406: v25.91,38.1 25.91,35.56 v25.78,35.31
N$19
  Top 0.406: U1.5 27.73,42.37 26.67,43.43 26.67,44.2 26.29,44.58 | R10.1 26.29,44.58 | 26.29,44.58 26.67,44.96 26.67,45.59 26.42,45.85 23.5,45.85 23.24,45.72 22.23,45.72 21.59,46.23 21.59,47.37 20.95,47.88 R12.2
N$20  (via drill 0.6)
  Top 0.406: U6.14 11.28,33.63 v11.43,33.78 | R27.2 21.12,42.93 17.78,42.93 v17.4,42.55
  Bottom 0.406: v11.43,33.78 11.94,34.29 11.94,39.62 14.61,42.16 17.02,42.16 v17.4,42.55
N$21
  Top 0.406: U1.4 28.26,43.37 27.69,43.94 27.69,46.99 26.92,47.75 25.87,47.75 R8.1
N$22
  Top 0.406: U1.10 27.21,37.37 26.67,36.83 R9.1
N$23
  Top 0.406: U2.10 25.01,13.24 R15.1
N$24
  Top 0.406: U2.4 28.26,19.24 27.18,20.32 25.91,20.32 24.89,19.3 22.35,19.3 22.1,19.05 R14.1
N$27  (via drill 0.6)
  Top 0.406: U6.36 22.84,28.85 23.5,28.19 23.62,28.19 v24,27.81 | v18.92,13.08 18.92,13.59 19.81,14.48 R17.2
  Bottom 0.406: v24,27.81 23.88,27.69 23.88,25.15 22.61,23.88 22.61,22.1 22.48,21.97 22.48,17.14 20.57,15.24 20.57,14.86 v18.92,13.08
N$28
  Top 0.406: U2.8 26.16,15.24 25.53,15.88 17.65,15.88 17.53,15.75 R22.1 17.11,15.62 17.65,15.62 17.78,15.49 17.78,14.1 17.4,13.72 R23.1
N$29
  Top 0.406: U1.8 26.16,39.37 23.88,41.66 22.48,41.66 21.72,40.89 17.27,40.89 16.13,42.04 16.13,43.18 16.38,43.43 16.38,44.32 16.26,44.45 R21.1 16,44.45 16.38,44.83 16.38,45.21 15.88,45.72 13.21,45.72 12.19,44.7 12.19,44.07 11.56,43.43 R20.1
N$32  (via drill 0.6)
  Top 0.406: U6.30 15.82,29.79 v16.26,30.35 | R10.2 23.91,44.45 21.84,44.45 v21.59,44.7
  Bottom 0.406: v21.59,44.7 21.59,38.86 21.34,38.61 20.07,38.61 19.05,37.59 19.05,35.56 19.18,35.43 19.18,31.24 18.16,30.23 16.38,30.23 v16.26,30.35
N$33  (via drill 0.6)
  Top 0.406: U6.31 16.61,28.3 v17.14,28.83 | R11.2 22.35,38.86 22.1,39.12 22.1,39.88 22.73,40.51 v23.24,40.51
  Bottom 0.406: v23.24,40.51 23.37,40.39 23.37,38.35 22.61,37.59 20.32,37.59 19.81,37.08 19.81,35.94 20.19,35.56 20.19,30.73 18.8,29.34 17.53,29.34 v17.14,28.83
N$35  (via drill 0.6)
  Top 0.406: U6.37 18.72,29.64 18.41,29.34 18.41,27.81 v18.03,27.43 | R14.2 v18.54,19.3
  Bottom 0.406: v18.03,27.43 18.41,27.43 18.92,26.92 18.92,19.43 v18.54,19.3
N$36  (via drill 0.6)
  Top 0.406: R15.2 22.35,13.21 v22.1,12.83 | U6.38 20.85,30.45 21.59,29.72 23.11,29.72 23.62,29.21 24.64,29.21 25.78,28.07 25.78,27.69 v25.91,27.56
  Bottom 0.406: v25.91,27.56 26.42,27.05 26.42,25.15 24.64,23.37 24.64,21.34 24.26,20.95 24.26,16.51 22.86,15.11 22.86,13.72 v22.1,12.83
N$37  (via drill 0.6)
  Top 0.406: U6.27 13.44,26.95 v13.08,27.3 | R16.2 14.35,19.18 13.72,19.81 13.72,20.57 v13.59,20.7
  Bottom 0.406: v13.08,27.3 13.72,26.67 13.72,21.21 v13.59,20.7
N$39  (via drill 0.6)
  Top 0.406: v20.19,45.85 19.43,46.48 17.78,46.48 16.64,47.62 11.94,47.62 11.56,47.24 11.56,46.35 10.79,45.59 5.97,45.59 5.45,45.08 QEI1.2 | U6.2 17.42,38 v18.41,38.99
  Bottom 0.406: v20.19,45.85 20.19,44.07 20.57,43.69 20.57,40.64 19.05,39.12 18.54,39.12 v18.41,38.99
N$40  (via drill 0.6)
  Top 0.406: QEI1.4 6,42.58 6.35,42.93 6.35,44.45 6.73,44.83 11.18,44.83 12.45,46.1 12.45,46.74 12.57,46.86 16.13,46.86 17.53,45.47 18.03,45.47 v18.54,44.96 | U6.3 16.61,38.51 v16.38,38.73
  Bottom 0.406: v18.54,44.96 18.8,44.96 19.3,44.45 19.3,43.69 19.68,43.31 19.68,41.15 18.67,40.13 17.78,40.13 v16.38,38.73
N$43
  Top 0.406: U2.7 26.43,16.24 25.4,17.14 R26.1
N$44
  Top 0.406: U6.25 11.84,24.49 12.06,24.26 13.08,24.26 13.34,24 13.34,23.37 13.97,22.73 13.97,22.1 15.49,20.57 24.64,20.57 25.27,21.21 26.29,21.21 27.18,22.1 27.18,22.48 28.96,24.26 29.84,24.26 29.97,24.38 29.97,25.15 29.92,25.3 | R29.1 29.84,25.53 29.92,25.3 | 29.92,25.3 30.35,25.73 30.35,26.29 30.61,26.54 R28.2
N$45  (via drill 0.6)
  Top 0.406: D1.A v60.58,13.21 | LED2.4 67.81,13.96 68.07,14.22 68.07,14.48 67.56,14.99 v67.31,14.99
  Bottom 0.406: v60.58,13.21 60.71,13.46 61.21,13.97 63.5,13.97 63.75,14.22 66.55,14.22 v67.31,14.99
N$46
  Top 0.406: U1.7 26.43,40.37 23.88,42.93 22.82,42.93 R27.1
N$47
  Top 0.406: U6.7 13.44,37.87 12.95,38.61 C1.1
N$49  (via drill 0.6)  (2 unrouted)
  Top 0.305: U1.13 35.39,34.37 36.07,35.05 v36.07,36.32 | 36.07,37.08 35.38,39.23 | 35.38,39.23 35.31,39.45 | 35.31,39.45 33.78,44.2 U1.3 | U1.23 35.38,39.23 | U2.13 35.05,10.41 v36.07,12.19 33.53,20.07 U2.3 | Q1.6 51.36,25.73 Q1.9 | U1.NC/VCC@1 U1.NC/VCC 35.23,39.37 35.31,39.45 | 46.74,15.24 U2.23 U2.NC/VCC@1 | LED3.1 48.51,27.43 49.02,26.92 49.02,26.38 | Q1.5 51.65,26.38 51.69,26.42
  Top 0.406: Q1.5 49.02,26.38 34.59,26.38 34.42,26.54 R28.1 | U2.23 37.08,15.24 v36.07,14.22
  Top 0.61: C5.1 52.45,35.31 v53.34,36.32 | C6.1 52.32,19.81 53.47,20.95
  Top 1.676: v53.09,11.68 53.85,12.45 C3.+ 53.85,16 54.61,17.02 54.61,19.81 53.47,20.95 51.88,22.55 arc-45 51.69,23 Q1.9 51.69,26.42 51.69,27.55 arc-45 51.88,28 54.61,30.73 54.61,35.05 v53.34,36.32 53.85,36.83 C4.+ | v36.07,12.19 36.07,12.45 | v36.07,36.32 36.07,37.08 | U2.NC/VCC 35.11,15.18 v36.07,14.22 | 35.38,39.23 35.38,39.04 v36.07,38.35
  Bottom 1.676: v53.09,11.68 46.74,11.68 44.7,9.65 38.61,9.65 v36.07,12.19 v36.07,14.22 | v53.34,36.32 38.1,36.32 | 38.1,36.32 v36.07,38.35 v36.07,36.32 38.1,36.32
N$50  (via drill 0.6)
  Top 0.406: LED1.2 67.56,40.65 67.82,40.39 67.82,40.13 v67.31,39.62 | D4.A v60.58,41.15
  Bottom 0.406: v67.31,39.62 65.28,41.15 v60.58,41.15
N$52  (via drill 0.6)
  Top 0.406: LED2.2 68.32,12.96 v68.33,12.95 | D2.A 60.96,14.22 60.96,14.99 61.47,15.49 v61.59,15.49
  Bottom 0.406: v68.33,12.95 68.33,15.49 67.82,16 66.8,16 66.29,15.49 v61.59,15.49
N$53  (via drill 0.6)
  Top 0.406: R25.2 59.05,11.05 v59.18,10.92 | LED2.1 v64.25,12.96 64.01,13.21 D1.C
  Bottom 0.406: v64.25,12.96 62.24,12.96 61.21,11.94 60.2,11.94 v59.18,10.92
PWM1H2  (via drill 0.6)
  Top 0.406: U6.10 11.02,35.41 v10.67,35.05 | R26.2 22.48,17.14 22.1,16.76 17.91,16.76 16.76,17.91 14.1,17.91 12.32,19.68 12.32,22.1 v12.45,22.23
  Bottom 0.406: 10.41,34.8 v10.67,35.05 10.29,34.67 10.29,33.15 11.3,32.13 11.3,30.35 10.54,29.59 10.54,27.05 10.92,26.67 11.68,26.67 12.45,25.91 v12.45,22.23
RA0  (via drill 0.6)
  Top 0.406: R8.2 23.37,47.88 22.73,47.24 v22.73,46.86 | U6.19 10.24,29.64 10.67,29.21 12.95,29.21 v13.08,29.08
  Bottom 0.406: v22.73,46.86 22.61,46.99 18.54,46.99 17.27,45.72 17.27,44.45 18.16,43.69 18.67,43.18 18.67,41.53 18.03,40.89 17.27,40.89 16.26,39.88 15.62,39.88 15.24,39.5 15.24,37.08 13.59,35.43 13.59,32.89 13.08,32.38 v13.08,29.08
RA1  (via drill 0.6)
  Top 0.406: U6.20 9.75,28.85 10.67,27.94 11.68,27.94 v11.68,28.07 | v15.49,41.02 16.51,40.13 19.56,40.13 21.97,37.72 21.97,37.21 22.48,36.7 R9.2
  Bottom 0.406: v11.68,28.07 11.94,28.19 11.94,29.72 12.19,30.1 12.19,32.77 12.7,33.27 12.7,35.69 12.83,35.81 12.83,38.48 v15.49,41.02
RB2  (via drill 0.6)
  Top 0.406: U6.23 10.24,24.97 9.91,24.64 9.4,24.64 | 9.4,24.64 8.89,25.15 8.89,25.65 8.64,25.91 v7.24,25.91 6.86,25.53 6.86,25.15 6.6,24.89 C14.1 | R20.2 v7.62,43.43 | D6.A 8.89,24.13 9.4,24.64
  Bottom 0.406: v7.62,43.43 7.62,31.75 8,31.37 8,26.67 v7.24,25.91
RB3
  Top 0.406: 14.99,15.75 R22.2 14.48,15.75 14.1,16.13 14.1,16.64 11.18,19.56 | U6.24 11.02,24.03 11.18,23.88 | 11.18,23.88 11.18,19.56 | 11.18,23.88 10.54,23.88 10.29,23.62 D5.A | C13.1 7.11,21.34 9.14,19.3 10.79,19.3 11.18,19.56
RB6  (via drill 0.6)
  Top 0.406: U6.4 15.82,35.87 16.13,35.56 17.02,35.56 17.53,35.05 v17.91,35.05
  Bottom 0.406: v17.91,35.05 16.51,35.81 15.24,35.81 14.48,35.05 14.48,32.64 13.97,32.13 13.97,29.97 14.22,29.72 14.22,28.57 15.24,27.56 15.24,17.14 10.92,12.83 10.92,11.3 10.41,10.79 4.56,10.79 QEI2.2
RB7  (via drill 0.6)
  Top 0.406: 14.99,36.83 U6.5 15.01,35.03 v15.75,34.54
  Bottom 0.406: 16,34.29 v15.75,34.54 15.75,31.75 14.99,30.99 14.99,29.21 16.13,28.07 16.13,16.76 12.06,12.7 12.06,9.53 10.79,8.26 4.58,8.26 QEI2.4
RC8  (via drill 0.6)
  Top 0.406: U4.1 12.83,10.79 12.45,11.18 | 12.45,11.18 12.03,11.18 R1.1 | S1.2 8.51,16.64 8,16.13 8,13.97 9.4,12.57 12.57,12.57 12.95,12.19 | 12.95,12.19 v13.21,11.94 | 12.95,12.19 12.95,11.68 12.45,11.18 | U6.32 v17.42,24.11
  Bottom 0.406: v17.42,24.11 17.42,20.22 17.02,19.81 17.02,16.38 15.11,14.48 15.11,12.57 14.48,11.94 v13.21,11.94
RC9  (via drill 0.6)
  Top 0.406: U6.35 22,28.04 23.5,26.54 24.51,26.54 v25.15,25.91 | 16,11.56 16,10.16 15.37,9.53 U4.2 13.34,9.53 13.08,9.27 R2.1 | 10.92,15.37 S1.1 9.78,15.37 9.53,15.11 9.53,13.97 10.03,13.46 13.59,13.46 15.11,11.94 15.49,11.94 15.88,11.56 16,11.56 | 16,11.56 16.38,11.81 19.81,11.81 v20.45,12.45
  Bottom 0.406: v25.15,25.91 25.15,25.15 23.62,23.62 23.62,21.59 23.37,21.34 23.37,16.89 21.84,15.37 21.84,14.61 20.57,13.34 20.57,12.57 v20.45,12.45
U2ENA  (via drill 0.6)
  Top 0.406: R18.2 v26.92,23.88 | U2.5 27.99,18.24 27.43,18.8 26.67,18.8 v26.42,19.05 25.78,18.41 22.61,18.41 21.84,17.65 18.29,17.65 17.02,18.92 R16.1
  Bottom 0.406: v26.92,23.88 27.3,23.5 27.3,19.81 v26.42,19.05
U2ENB  (via drill 0.6)
  Top 0.406: U2.9 26.02,14.24 25.78,14.48 24.51,14.48 v24.26,14.73 24.13,14.61 R17.1 | R19.2 24.13,21.84 24.89,22.61 v25.78,22.61
  Bottom 0.406: v25.78,22.61 25.78,21.21 25.15,20.57 25.15,15.62 v24.26,14.73
VBAT  (via drill 0.6)
  Top 0.305: Q1.1 55.33,24.43 56.39,23.37 59.69,23.37 60.96,24.64 60.96,25.65 J3.2 J3.1 | Q1.2 55.57,25.07 55.63,25.02 | Q1.3 55.55,25.73 55.63,25.65
  Top 0.406: U2.12 28.51,11.24 v27.56,10.41 | U1.12 28.26,35.37 27.94,35.05 27.94,31.62 28.57,30.99 29.46,30.99 29.97,30.48 v29.97,29.97
  Bottom 0.406: 60.96,28.7 J3.1 59.13,30.48 48.51,30.48 48.01,29.97 v29.97,29.97 30.23,28.96 30.23,13.46 v27.56,10.41
  pour Top: 54.61,25.78 56.13,25.78 56.13,25.15 57.15,24.13 58.67,24.13 59.69,25.15 59.69,29.72 59.94,29.97 62.48,29.97 62.74,29.72 62.74,23.37 61.21,21.84 55.63,21.84 54.61,22.86
VCC  (via drill 0.6)  (1 unrouted)
  Top 0.406: R5.2 25.02,9.14 | R5.2 25.27,9.14 | 22.48,33.91 21.84,33.91 21.21,33.4 21.21,32.26 20.98,32.03 U6.40 19.58,32.03 19.56,32 18.8,32 18.16,32.51 14.99,32.51 14.22,31.75 U6.28 14.22,23.75 14.99,22.99 14.99,22.35 16,21.34 18.67,21.34 19.18,21.84 | 22.48,33.91 C9.1 | U6.17 v10.16,31.24 | U4.8 20.7,10.79 v21.34,10.92 | R6.2 25.4,11.18 25.91,10.92 25.91,9.14 | 25.4,7.11 R4.2 25.65,7.11 | 25.91,9.14 25.91,8.13 | 25.91,8.13 25.91,7.37 25.65,7.11 | v26.54,8.76 25.91,8.13 | 25.65,7.11 v26.42,6.35 26.54,6.48 C2.1 | R5.2 25.91,9.14 | JP3.2 5.08,35.05 6.86,36.7 8.64,36.7 9.27,37.34 9.27,37.85 8.89,38.1 | C8.1 18.8,22.61 19.18,22.23 19.18,21.84 | R19.1 20.57,21.84 | 20.57,21.84 19.18,21.84 | R18.1 21.08,23.88 20.83,23.62 20.83,22.1 20.57,21.84 | 22.48,33.91 23.11,33.91 23.75,33.4 23.88,33.27 23.88,31.88 24.51,31.24 25.15,31.24 25.78,31.88 R13.1 | R2.2 9.27,9.27 8.38,10.16 8.38,11.94 9.02,11.3 R1.2 | R3.2 9.02,7.24 v8.89,7.11 | R12.1 17.65,47.88 17.02,48.51 10.92,48.51 10.67,48.26 10.67,47.24 v10.29,46.86 | R7.2 8.89,38.1 | 8.89,38.1 9.27,38.35 9.27,39.37 8.76,39.88 8.76,40.01 | C10.1 8.76,40.01 | 8.76,40.01 v8.89,40.13 | D6.C 8.89,21.08 9.4,20.57 v9.91,20.57 10.29,20.95 D5.C
  Top 1.016: v10.16,31.24 11.18,31.24 11.68,31.75 14.22,31.75 | v8.89,7.11 8.13,7.87 8.13,11.94 v7.87,12.19
  Bottom 0.406: 9.53,6.35 9.65,6.22 | v21.34,10.92 24.26,8.76 v26.54,8.76
  Bottom 0.61: P9.3 P9.4
  Bottom 0.813: 9.65,6.22 5.08,6.22 4.32,5.46 P9.4 | 9.53,6.35 9.53,6.48 v8.89,7.11
  Bottom 1.016: 9.65,6.22 26.04,6.22 v26.42,6.35 | v7.87,12.19 9.4,13.46 10.16,14.22 10.16,20.32 | v10.29,46.86 10.16,46.74 10.16,41.4 9.14,40.39 | 9.14,40.39 v8.89,40.13 | 9.14,40.39 9.14,32.51 10.16,31.5 v10.16,31.24 9.27,30.35 9.27,25.78 10.16,24.89 10.16,20.32 | 10.16,20.32 v9.91,20.57
VCC/2  (via drill 0.6)
  Top 0.406: C11.1 5.85,46.61 QEI1.1 | v7.37,19.3 C12.1
  Top 0.61: P9.8 7.75,6.1 7.11,6.1 6.6,6.6 6.6,11.43 6,12.04 QEI2.1
  Bottom 0.61: P9.7 P9.8 | QEI2.1 3.21,12.04 2.67,12.7 2.67,19.18 3.05,19.56 | QEI1.1 3.15,46.33 2.79,45.97 2.79,39.88 3.05,39.62 3.05,19.56 | 3.05,19.56 3.3,19.3 v7.37,19.3

### Text on the board
Bottom: DMCC Mk.6 - http://exadler.com
tPlace: Motor 1 | Battery / 28V Max | Dual Motor Control Cape | (DMCC) Mk.6 | Power / LED | Motor 2 | Top / Component Layer